# Altium project Macropad V1.0.PrjPcb
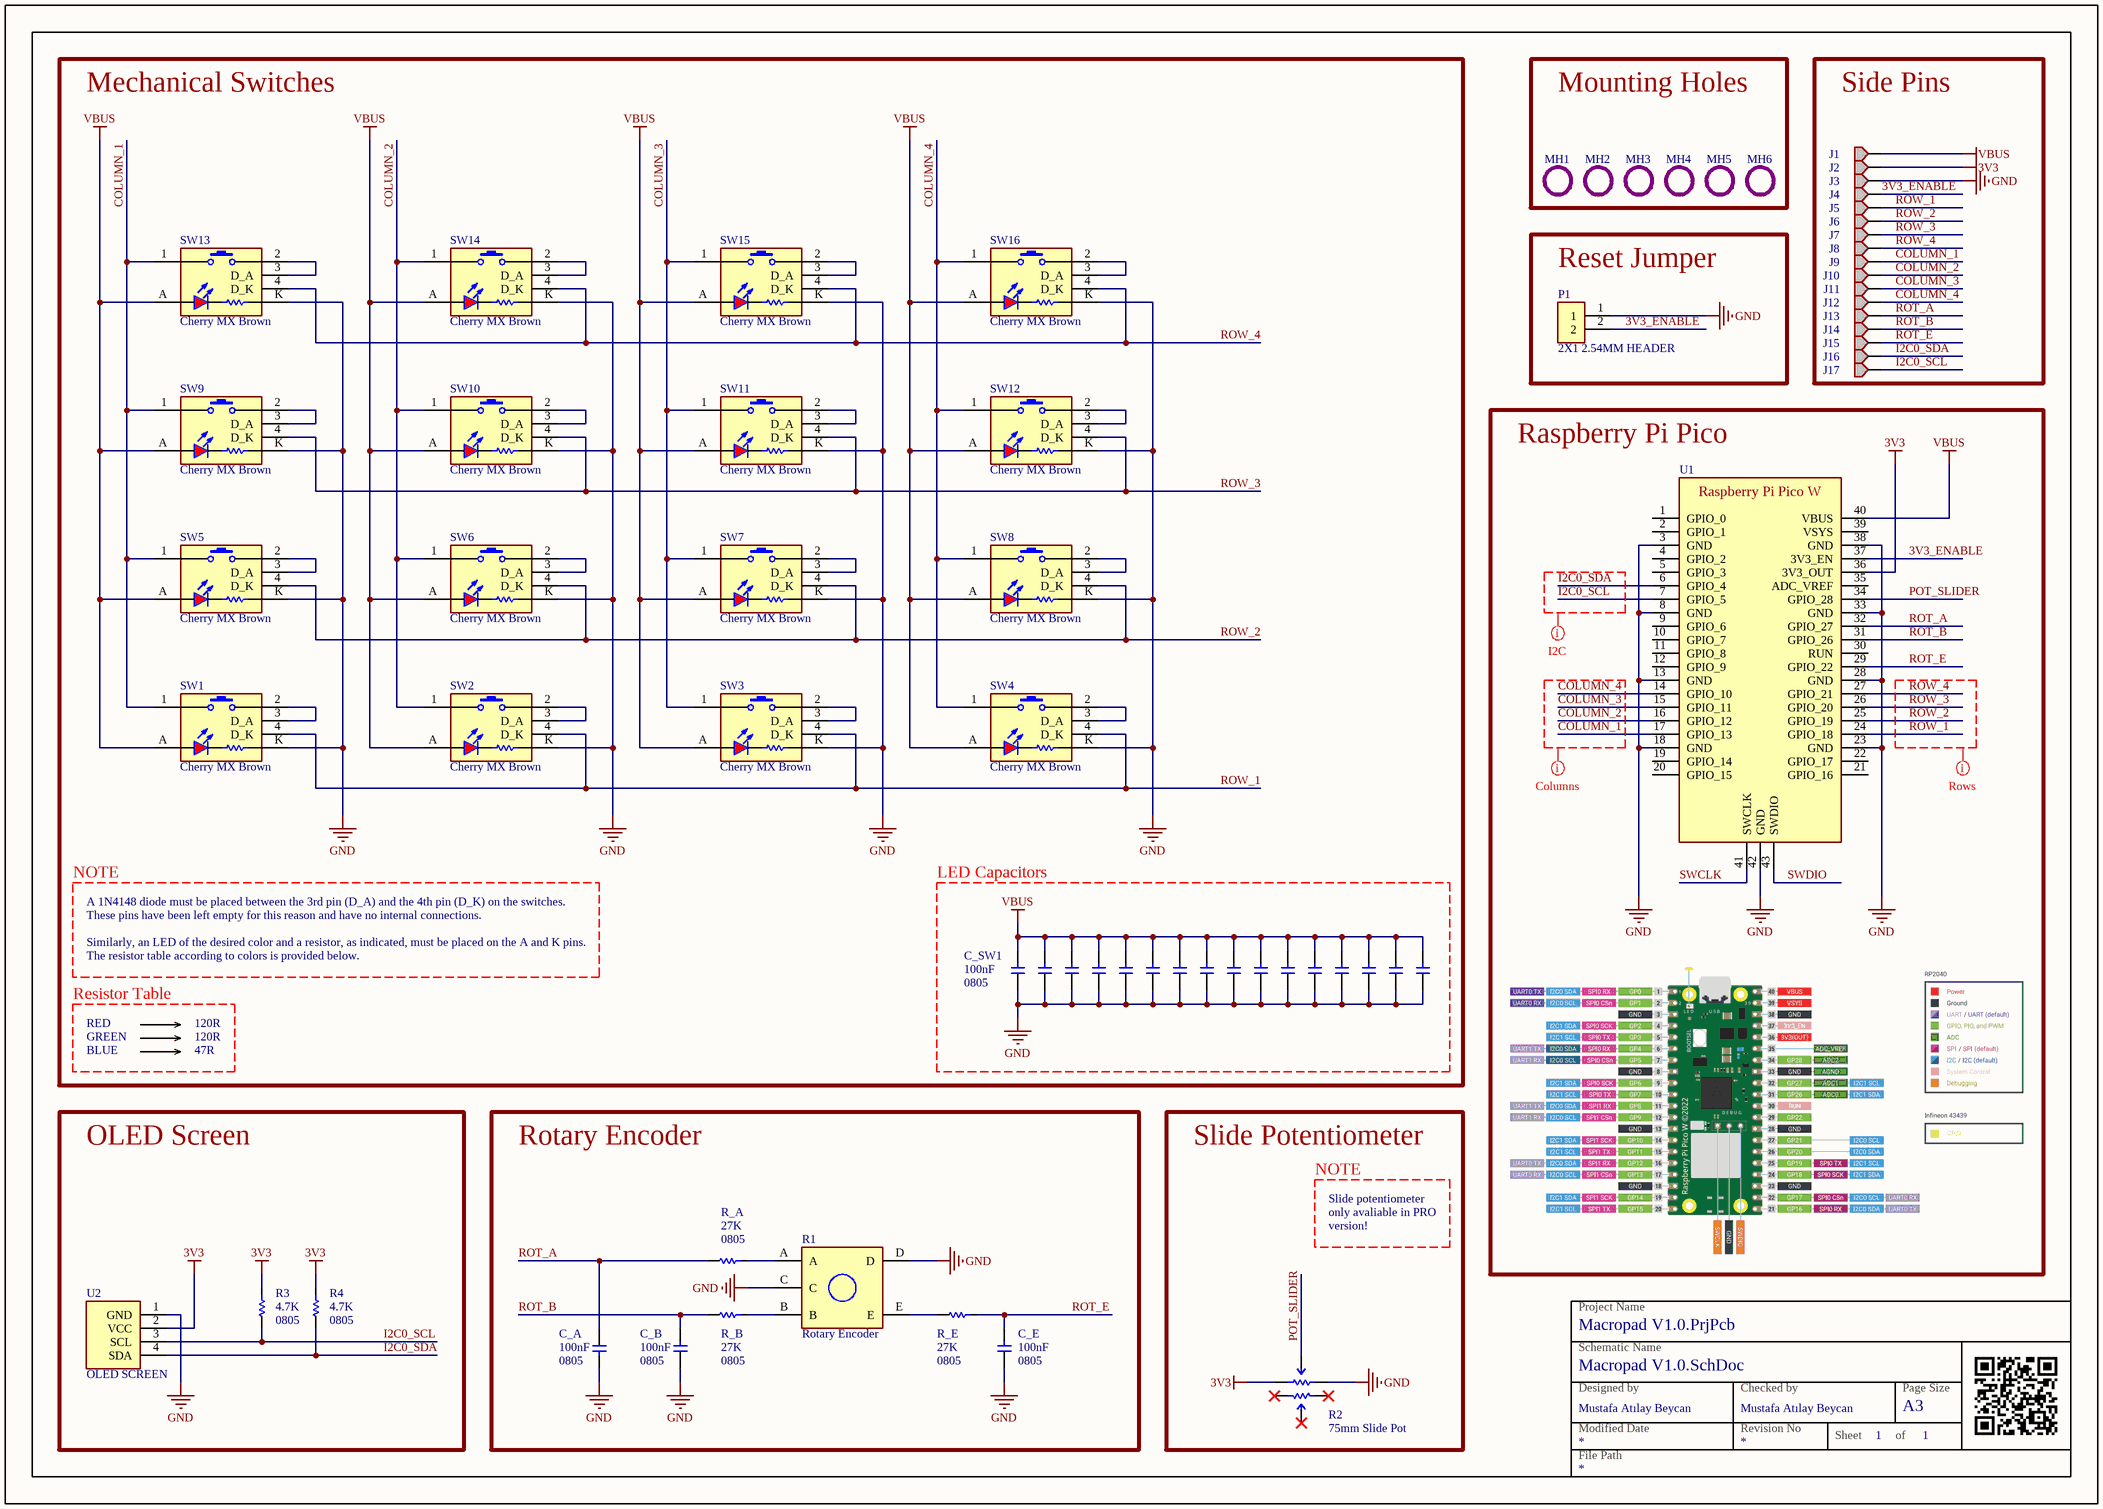
[diagram p0: Macropad V1.0.SchDoc]
1 sheet, 68 parts. Net scope: global (net labels, ports and power ports of the same name join across sheets).
Board files: Macropad LITE.PcbDoc, Macropad PRO.PcbDoc, Taban.PcbDoc, Plate - LITE.PcbDoc

## Sheet Macropad V1.0.SchDoc
size A3; ApprovedBy: Mustafa Atılay Beycan; CheckedBy: Mustafa Atılay Beycan; Author: Mustafa Atılay Beycan; CompanyName: Mustafa Atılay Beycan; DrawnBy: Mustafa Atılay Beycan; Engineer: Mustafa Atılay Beycan; Organization: Mustafa Atılay Beycan; SheetNumber: 1; SheetTotal: 1; ImagePath: \\dcsrv01\Tasarım_Dosyaları_Son_Versiyonlar\Library\Templates\wipelot.png

### Parts
C_A  Capacitance: 100nF  Package: 0805  [CAP 0805]  (hidden comment: CAP CER)
C_B  Capacitance: 100nF  Package: 0805  [CAP 0805]  (hidden comment: CAP CER)
C_E  Capacitance: 100nF  Package: 0805  [CAP 0805]  (hidden comment: CAP CER)
C_SW1  Capacitance: 100nF  Package: 0805  [CAP 0805]  (hidden comment: CAP CER)
C_SW2  CAP CER  [CAP 0805]  (value not drawn)
C_SW3  CAP CER  [CAP 0805]  (value not drawn)
C_SW4  CAP CER  [CAP 0805]  (value not drawn)
C_SW5  CAP CER  [CAP 0805]  (value not drawn)
C_SW6  CAP CER  [CAP 0805]  (value not drawn)
C_SW7  CAP CER  [CAP 0805]  (value not drawn)
C_SW8  CAP CER  [CAP 0805]  (value not drawn)
C_SW9  CAP CER  [CAP 0805]  (value not drawn)
C_SW10  CAP CER  [CAP 0805]  (value not drawn)
C_SW11  CAP CER  [CAP 0805]  (value not drawn)
C_SW12  CAP CER  [CAP 0805]  (value not drawn)
C_SW13  CAP CER  [CAP 0805]  (value not drawn)
C_SW14  CAP CER  [CAP 0805]  (value not drawn)
C_SW15  CAP CER  [CAP 0805]  (value not drawn)
C_SW16  CAP CER  [CAP 0805]  (value not drawn)
J1  PAD 1 PIN  [PAD 1 PIN]  (value not drawn)
J2  PAD 1 PIN  [PAD 1 PIN]  (value not drawn)
J3  PAD 1 PIN  [PAD 1 PIN]  (value not drawn)
J4  PAD 1 PIN  [PAD 1 PIN]  (value not drawn)
J5  PAD 1 PIN  [PAD 1 PIN]  (value not drawn)
J6  PAD 1 PIN  [PAD 1 PIN]  (value not drawn)
J7  PAD 1 PIN  [PAD 1 PIN]  (value not drawn)
J8  PAD 1 PIN  [PAD 1 PIN]  (value not drawn)
J9  PAD 1 PIN  [PAD 1 PIN]  (value not drawn)
J10  PAD 1 PIN  [PAD 1 PIN]  (value not drawn)
J11  PAD 1 PIN  [PAD 1 PIN]  (value not drawn)
J12  PAD 1 PIN  [PAD 1 PIN]  (value not drawn)
J13  PAD 1 PIN  [PAD 1 PIN]  (value not drawn)
J14  PAD 1 PIN  [PAD 1 PIN]  (value not drawn)
J15  PAD 1 PIN  [PAD 1 PIN]  (value not drawn)
J16  PAD 1 PIN  [PAD 1 PIN]  (value not drawn)
J17  PAD 1 PIN  [PAD 1 PIN]  (value not drawn)
MH1  MOUNTING HOLE  [MH 2.7MM]  (value not drawn)  (no BOM)
MH2  MOUNTING HOLE  [MH 2.7MM]  (value not drawn)  (no BOM)
MH3  MOUNTING HOLE  [MH 2.7MM]  (value not drawn)  (no BOM)
MH4  MOUNTING HOLE  [MH 2.7MM]  (value not drawn)  (no BOM)
MH5  MOUNTING HOLE  [MH 2.7MM]  (value not drawn)  (no BOM)
MH6  MOUNTING HOLE  [MH 2.7MM]  (value not drawn)  (no BOM)
P1  2X1 2.54MM HEADER  [HDR 2 PIN 2.54MM]
R1  Rotary Encoder  [POT - ROTARY ENCODER]
R2  75mm Slide Pot  [POT - SLIDER 75MM]
R3  Resistance: 4.7K  Package: 0805  [RES 0805]  (hidden comment: RES CHIP)
R4  Resistance: 4.7K  Package: 0805  [RES 0805]  (hidden comment: RES CHIP)
R_A  Resistance: 27K  Package: 0805  [RES 0805]  (hidden comment: RES CHIP)
R_B  Resistance: 27K  Package: 0805  [RES 0805]  (hidden comment: RES CHIP)
R_E  Resistance: 27K  Package: 0805  [RES 0805]  (hidden comment: RES CHIP)
SW1  Cherry MX Brown  [SW - CHERRY MX 1U]
SW2  Cherry MX Brown  [SW - CHERRY MX 1U]
SW3  Cherry MX Brown  [SW - CHERRY MX 1U]
SW4  Cherry MX Brown  [SW - CHERRY MX 1U]
SW5  Cherry MX Brown  [SW - CHERRY MX 1U]
SW6  Cherry MX Brown  [SW - CHERRY MX 1U]
SW7  Cherry MX Brown  [SW - CHERRY MX 1U]
SW8  Cherry MX Brown  [SW - CHERRY MX 1U]
SW9  Cherry MX Brown  [SW - CHERRY MX 1U]
SW10  Cherry MX Brown  [SW - CHERRY MX 1U]
SW11  Cherry MX Brown  [SW - CHERRY MX 1U]
SW12  Cherry MX Brown  [SW - CHERRY MX 1U]
SW13  Cherry MX Brown  [SW - CHERRY MX 1U]
SW14  Cherry MX Brown  [SW - CHERRY MX 1U]
SW15  Cherry MX Brown  [SW - CHERRY MX 1U]
SW16  Cherry MX Brown  [SW - CHERRY MX 1U]
U1  Raspberry Pi Pico W  [MOD - RP PICO W]  (value not drawn)
U2  OLED SCREEN  [0.91 OLED]

### Blocks framed on the sheet
Mechanical Switches: SW1-SW16
Mounting Holes: MH1-MH6
Side Pins: J1-J17
Reset Jumper: P1
Raspberry Pi Pico: U1
LED Capacitors: C_SW1-C_SW16
OLED Screen: R3 R4 U2
Rotary Encoder: C_A C_B C_E R1 R_A R_B R_E
Slide Potentiometer: R2

### Nets
3V3: J2.1 R2.1 R3.1 R4.1 U1.36(3V3_OUT) U2.2(VCC)
GND: C_A.1 C_B.2 C_E.2 C_SW1.2 C_SW2.2 C_SW3.2 C_SW4.2 C_SW5.2 C_SW6.2 C_SW7.2 C_SW8.2 C_SW9.2 C_SW10.2 C_SW11.2 C_SW12.2 C_SW13.2 C_SW14.2 C_SW15.2 C_SW16.2 J3.1 P1.1 R1.C R1.D R2.3 SW1.K SW2.K SW3.K SW4.K SW5.K SW6.K SW7.K SW8.K SW9.K SW10.K SW11.K SW12.K SW13.K SW14.K SW15.K SW16.K U1.3(GND) U1.8(GND) U1.13(GND) U1.18(GND) U1.23(GND) U1.28(GND) U1.33(GND) U1.38(GND) U1.42(GND) U2.1(GND)
VBUS: C_SW1.1 C_SW2.1 C_SW3.1 C_SW4.1 C_SW5.1 C_SW6.1 C_SW7.1 C_SW8.1 C_SW9.1 C_SW10.1 C_SW11.1 C_SW12.1 C_SW13.1 C_SW14.1 C_SW15.1 C_SW16.1 J1.1 SW1.A SW2.A SW3.A SW4.A SW5.A SW6.A SW7.A SW8.A SW9.A SW10.A SW11.A SW12.A SW13.A SW14.A SW15.A SW16.A U1.40(VBUS)
3V3_ENABLE: J4.1 P1.2 U1.37(3V3_EN)
COLUMN_1: J9.1 SW1.1(S1) SW5.1(S1) SW9.1(S1) SW13.1(S1) U1.17(GPIO_13)
COLUMN_2: J10.1 SW2.1(S1) SW6.1(S1) SW10.1(S1) SW14.1(S1) U1.16(GPIO_12)
COLUMN_3: J11.1 SW3.1(S1) SW7.1(S1) SW11.1(S1) SW15.1(S1) U1.15(GPIO_11)
COLUMN_4: J12.1 SW4.1(S1) SW8.1(S1) SW12.1(S1) SW16.1(S1) U1.14(GPIO_10)
I2C0_SCL: J17.1 R3.2 U1.7(GPIO_5) U2.3(SCL)
I2C0_SDA: J16.1 R4.2 U1.6(GPIO_4) U2.4(SDA)
POT_SLIDER: R2.2 U1.34(GPIO_28)
ROT_A: C_A.2 J13.1 R_A.2 U1.32(GPIO_27)
ROT_B: C_B.1 J14.1 R_B.2 U1.31(GPIO_26)
ROT_E: C_E.1 J15.1 R_E.1 U1.29(GPIO_22)
ROW_1: J5.1 SW1.4(D_K) SW2.4(D_K) SW3.4(D_K) SW4.4(D_K) U1.24(GPIO_18)
ROW_2: J6.1 SW5.4(D_K) SW6.4(D_K) SW7.4(D_K) SW8.4(D_K) U1.25(GPIO_19)
ROW_3: J7.1 SW9.4(D_K) SW10.4(D_K) SW11.4(D_K) SW12.4(D_K) U1.26(GPIO_20)
ROW_4: J8.1 SW13.4(D_K) SW14.4(D_K) SW15.4(D_K) SW16.4(D_K) U1.27(GPIO_21)
SWCLK: U1.41(SWCLK)
SWDIO: U1.43(SWDIO)
NetR1_A: R1.A R_A.1
NetR1_B: R1.B R_B.1
NetR1_E: R1.E R_E.2
NetSW1_2: SW1.2(S2) SW1.3(D_A)
NetSW2_2: SW2.2(S2) SW2.3(D_A)
NetSW3_2: SW3.2(S2) SW3.3(D_A)
NetSW4_2: SW4.2(S2) SW4.3(D_A)
NetSW5_2: SW5.2(S2) SW5.3(D_A)
NetSW6_2: SW6.2(S2) SW6.3(D_A)
NetSW7_2: SW7.2(S2) SW7.3(D_A)
NetSW8_2: SW8.2(S2) SW8.3(D_A)
NetSW9_2: SW9.2(S2) SW9.3(D_A)
NetSW10_2: SW10.2(S2) SW10.3(D_A)
NetSW11_2: SW11.2(S2) SW11.3(D_A)
NetSW12_2: SW12.2(S2) SW12.3(D_A)
NetSW13_2: SW13.2(S2) SW13.3(D_A)
NetSW14_2: SW14.2(S2) SW14.3(D_A)
NetSW15_2: SW15.2(S2) SW15.3(D_A)
NetSW16_2: SW16.2(S2) SW16.3(D_A)

Not connected (* = marked no-connect by the designer): R2 1'* 2'* 3'*; U1 1(GPIO_0) 2(GPIO_1) 4(GPIO_2) 5(GPIO_3) 9(GPIO_6) 10(GPIO_7) 11(GPIO_8) 12(GPIO_9) 19(GPIO_14) 20(GPIO_15) 21(GPIO_16) 22(GPIO_17) 30(RUN) 35(ADC_VREF) 39(VSYS)

### Layout directives
net class Columns: COLUMN_1, COLUMN_2, COLUMN_3, COLUMN_4
net class Rows: ROW_1, ROW_2, ROW_3, ROW_4
net class I2C: I2C0_SCL, I2C0_SDA

### Notes on the sheet
- NOTE
- A 1N4148 diode must be placed between the 3rd pin (D_A) and the 4th pin (D_K) on the switches.
- These pins have been left empty for this reason and have no internal connections.
- Similarly, an LED of the desired color and a resistor, as indicated, must be placed on the A and K pins.
- The resistor table according to colors is provided below.
- Resistor Table
- RED
- GREEN
- BLUE
- 120R
- 47R
- Slide potentiometer
- only avaliable in PRO
- version!
- Project Name
- Designed by
- Schematic Name
- Checked by
- Page Size
- File Path
- Modified Date
- Revision No
- Sheet
- of
- A3

### Library data of the parts
C_SW2-C_SW16 = CAP CER: Capacitance: 100nF; Link: *; Manufacturer: *; Manufacturer Part Number: *; Value: *; Tolerance: *; Temperature Coefficient: *; Mount: SMD; ALT MALZEME KODU: *; Voltage: *; Package: 0805
MH1-MH6 = MH
P1 = HDR - 2X1 2.54
R1 = POT - Rotary Encoder: Link: https://ozdisan.com/elektromekanik-komponentler/enkoder-urunleri/enkoderler/L-KLS4-EC1204-2C8A-15T/517994
R2 = POT - Slide Potentiometer Stereo
SW1-SW16 = Cherry MX Brown: MECHANICAL SWITCH CHERRY MX BROWN
U1 = MOD - RP PICO W: Link: https://www.raspberrypi.com/documentation/microcontrollers/raspberry-pi-pico.html
U2 = 0.91 OLED: 0.91 OLED SCREEN I2C
C_A C_B C_E C_SW1 = CAP CER: Link: *; Manufacturer: *; Manufacturer Part Number: *; Value: *; Tolerance: *; Temperature Coefficient: *; Mount: SMD; ALT MALZEME KODU: *; Voltage: *
R3 R4 R_A R_B R_E = RES CHIP: Link: *; Manufacturer: *; Manufacturer Part Number: *; Value: *; Tolerance: *; Power Rating: *; Mount: SMD; ALT MALZEME KODU: *